# Altium schematic sheet MainDesign_small.SchDoc
size A2
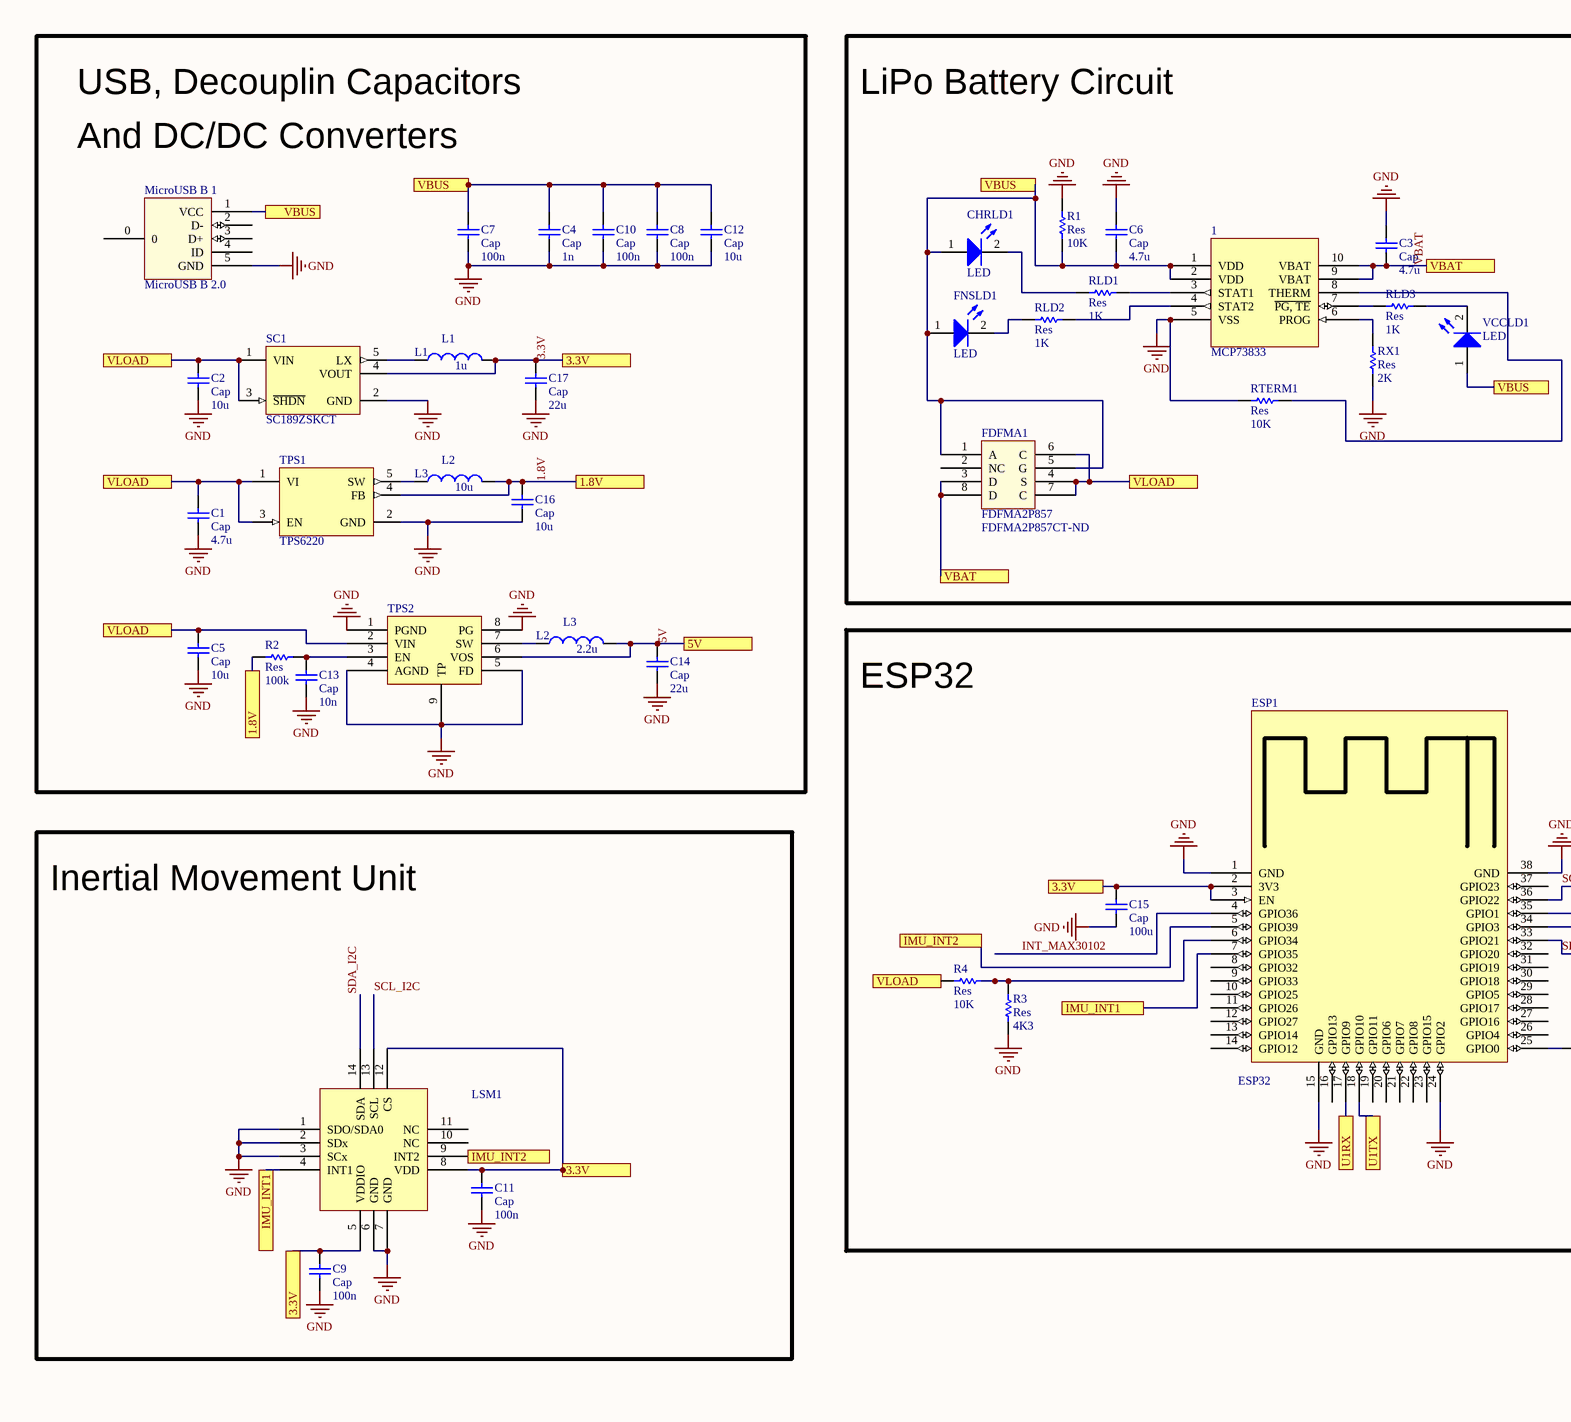
[diagram p0: MainDesign_small.SchDoc, left]
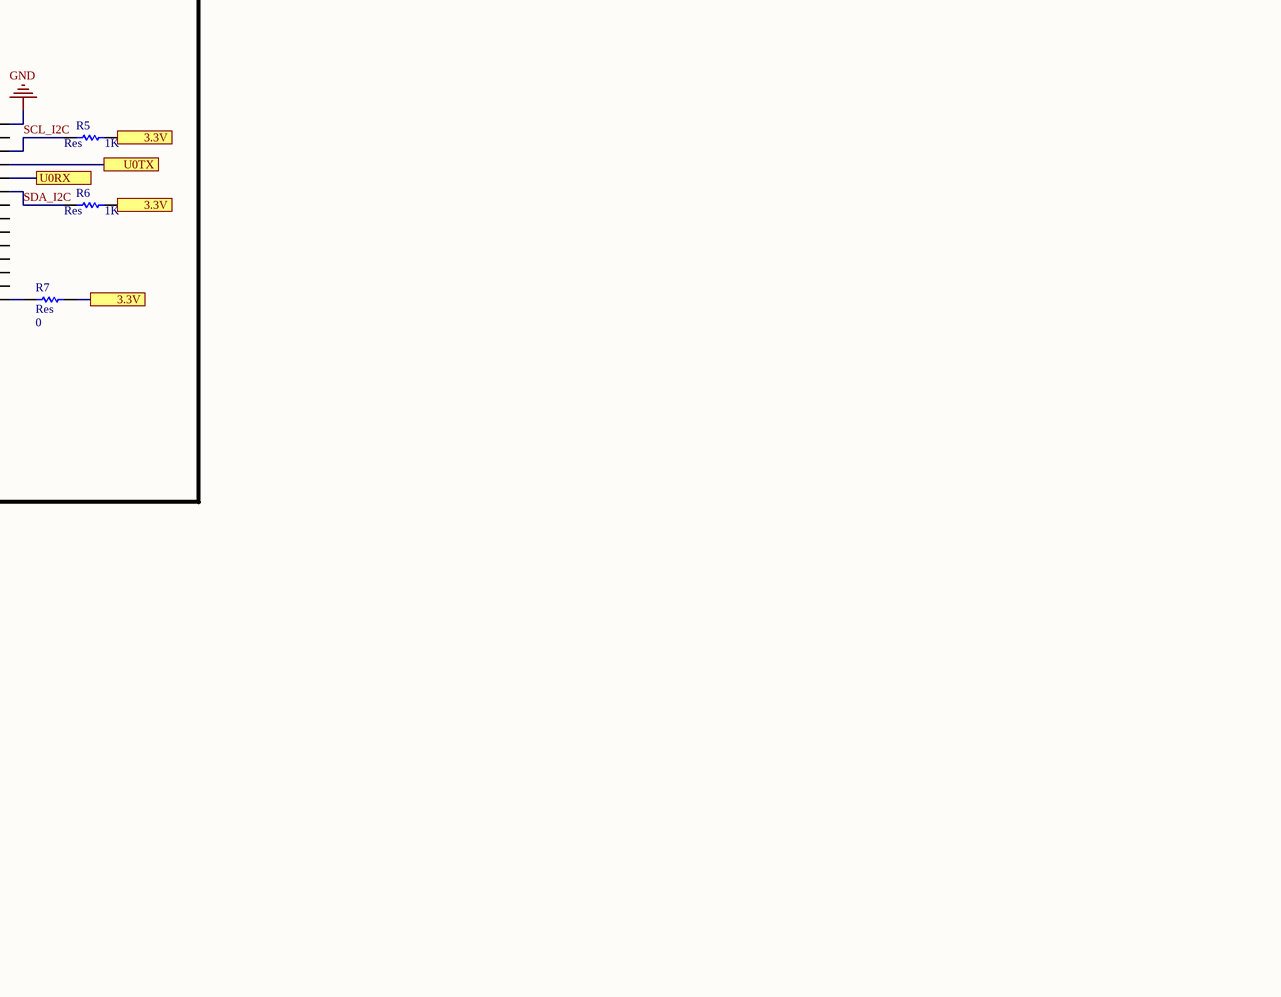
[diagram p1: MainDesign_small.SchDoc, right]

## Parts
1  MCP73833  [MCP73833/4]
C1  Cap  value 4.7u  [0603 Cap]
C2  Cap  value 10u  [0603 Cap]
C3  Cap  value 4.7u  [0603 Cap]
C4  Cap  value 1n  [0603 Cap]
C5  Cap  value 10u  [0603 Cap]
C6  Cap  value 4.7u  [0603 Cap]
C7  Cap  value 100n  [0603 Cap]
C8  Cap  value 100n  [0603 Cap]
C9  Cap  value 100n  [0603 Cap]
C10  Cap  value 100n  [0603 Cap]
C11  Cap  value 100n  [0603 Cap]
C12  Cap  value 10u  [0603 Cap]
C13  Cap  value 10n  [0603 Cap]
C14  Cap  value 22u  [0603 Cap]
C15  Cap  value 100u  [0603 Cap]
C16  Cap  value 10u  [0603 Cap]
C17  Cap  value 22u  [0603 Cap]
CHRLD1  LED  [0603 LED-BLUE]
ESP1  ESP32  [ESP32]
FDFMA1  FDFMA2P857  Supplier Part Number 1: FDFMA2P857CT-ND  [FDFMA2P857]
FNSLD1  LED  [0603 LED-BLUE]
L1  L1  value 1u  [0603 IND]
L2  L3  value 2.2u  [0603 IND]
L3  L2  value 10u  [0603 IND]
LSM1  LSM6DS3  [LSM6DS3]  (value not drawn)
MicroUSB_B_1  MicroUSB B 2.0  [MicroUSB B 2.0]
R1  Res  value 10K  [0603 Res]
R2  Res  value 100k  [0603 Res]
R3  Res  value 4K3  [0603 Res]
R4  Res  value 10K  [0603 Res]
R5  Res  value 1K  [0603 Res]
R6  Res  value 1K  [0603 Res]
R7  Res  value 0  [0603 Res]
RLD1  Res  value 1K  [0603 Res]
RLD2  Res  value 1K  [0603 Res]
RLD3  Res  value 1K  [0603 Res]
RTERM1  Res  value 10K  [0603 Res]
RX1  Res  value 2K  [0603 Res]
SC1  SC189ZSKCT  [SOT23-5]
TPS1  TPS6220  [SOT23-5]
TPS2  TPS62173DSGT  [TPS62173DSGT]  (value not drawn)
VCCLD1  LED  [0603 LED-BLUE]

## Blocks framed on the sheet
LiPo Battery Circuit: 1 C3 C6 CHRLD1 FDFMA1 FNSLD1 R1 RLD1-RLD3 RTERM1 RX1 VCCLD1
ESP32: C15 ESP1 R3-R7
Inertial Movement Unit: C9 C11 LSM1

## Ports
1.8V, 3.3V, 5V, IMU_INT1, IMU_INT2, U0RX, U0TX, U1RX, U1TX, VBAT, VBUS, VLOAD

## Nets
GND: 1.5(VSS) C1.1 C2.1 C3.2 C4.2 C5.2 C6.2 C7.2 C8.1 C9.2 C10.2 C11.1 C12.2 C13.1 C14.1 C15.1 C16.1 C17.1 ESP1.1(GND) ESP1.15(GND) ESP1.24(GPIO2) ESP1.38(GND) LSM1.1(SDO/SDA0) LSM1.2(SDx) LSM1.3(SCx) LSM1.6(GND) LSM1.7(GND) MicroUSB_B_1.5(GND) R1.2 R3.2 RTERM1.1 RX1.2 SC1.2(GND) TPS1.2(GND) TPS2.1(PGND) TPS2.4(AGND) TPS2.5(FD) TPS2.8(PG) TPS2.9(TP)
1.8V: C16.2 L3.2 R2.2 TPS1.4(FB) ; port 1.8V
3.3V: C9.1 C11.2 C15.2 C17.2 ESP1.2(3V3) ESP1.3(EN) L1.2 LSM1.5(VDDIO) LSM1.8(VDD) LSM1.12(CS) R5.2 R6.2 R7.1 SC1.4(VOUT) ; port 3.3V
5V: C14.2 L2.2 TPS2.6(VOS) ; port 5V
IMU_INT1: ESP1.7(GPIO35) LSM1.4(INT1) ; port IMU_INT1
IMU_INT2: ESP1.5(GPIO39) LSM1.9(INT2) ; port IMU_INT2
INT_MAX30102: ESP1.4(GPIO36)
SCL_I2C: ESP1.36(GPIO22) LSM1.13(SCL) R5.1
SDA_I2C: ESP1.33(GPIO21) LSM1.14(SDA) R6.1
U0RX: ESP1.34(GPIO3) ; port U0RX
U0TX: ESP1.35(GPIO1) ; port U0TX
U1RX: ESP1.17(GPIO9) ; port U1RX
U1TX: ESP1.18(GPIO10) ; port U1TX
VBAT: 1.9(VBAT) 1.10(VBAT) C3.1 FDFMA1.3(D) FDFMA1.8(D) ; port VBAT
VBUS: 1.1(VDD) 1.2(VDD) C4.1 C6.1 C7.1 C8.2 C10.1 C12.1 CHRLD1.1(A) FDFMA1.1(A) FDFMA1.5(G) FNSLD1.1(A) MicroUSB_B_1.1(VCC) R1.1 VCCLD1.1(A) ; port VBUS
VLOAD: C1.2 C2.2 C5.1 FDFMA1.4(S) FDFMA1.6(C) FDFMA1.7(C) R4.1 SC1.1(VIN) SC1.3(~{SHDN}) TPS1.1(VI) TPS1.3(EN) TPS2.2(VIN) ; port VLOAD
Net1_3: 1.3(STAT1) RLD1.1
Net1_4: 1.4(STAT2) RLD2.1
Net1_6: 1.6(PROG) RX1.1
Net1_7: 1.7(~{PG,_TE}) RLD3.2
Net1_8: 1.8(THERM) RTERM1.2
NetC13_2: C13.2 R2.1 TPS2.3(EN)
NetCHRLD1_2: CHRLD1.2(C) RLD1.2
NetESP1_6: ESP1.6(GPIO34) R3.1 R4.2
NetESP1_25: ESP1.25(GPIO0) R7.2
NetFNSLD1_2: FNSLD1.2(C) RLD2.2
NetL1_1: L1.1 SC1.5(LX)
NetL2_1: L2.1 TPS2.7(SW)
NetL3_1: L3.1 TPS1.5(SW)
NetRLD3_1: RLD3.1 VCCLD1.2(C)

Not connected (* = marked no-connect by the designer): ESP1 8(GPIO32) 9(GPIO33) 10(GPIO25) 11(GPIO26) 12(GPIO27) 13(GPIO14) 14(GPIO12) 16(GPIO13) 19(GPIO11) 20(GPIO6) 21(GPIO7) 22(GPIO8) 23(GPIO15) 26(GPIO4) 27(GPIO16) 28(GPIO17) 29(GPIO5) 30(GPIO18) 31(GPIO19) 32(GPIO20) 37(GPIO23); FDFMA1 2(NC); LSM1 10(NC) 11(NC); MicroUSB_B_1 0 2(D-) 3(D+) 4(ID)

## Notes on the sheet
- USB, Decouplin Capacitors
- And DC/DC Converters
- HELLO WORLD

## Library data of the parts
L1-L3 = Ind
SC1 = MCP1603T-330I/OS: 500mA Synchronous Buck Regulator, 3.3V, 2.0 MHz, 5-Pin TSOT, Industrial Temperature, Tape and Reel; Published: 29-Jan-2009; DatasheetVersion: revA, May-2007; PackageVersion: revAW, Oct-2008; PackageReference: TSOT-OS5; Publisher: Altium Limited; PackageDescription: 5-Lead Plastic Small Outline Transistor (OS) [TSOT]; ComponentLink1Description: Manufacturer Link; ComponentLink1URL: http://www.microchip.com; ComponentLink2Description: Datasheet; ComponentLink2URL: http://ww1.microchip.com/downloads/en/DeviceDoc/22042a.pdf; ComponentLink3Description: Packaging Specification; ComponentLink3URL: http://ww1.microchip.com/downloads/en/PackagingSpec/00049AW.pdf
1 = MCP73833: Supplier 1: Digi-Key; Supplier Part Number 1: MCP73833T-AMI/UNCT-ND
FDFMA1 = FDFMA2P857: Supplier 1: Digi-Key
LSM1 = LSM6DS3: Supplier 1: Digi-Key; Supplier Part Number 1: 497-15383-1-ND
TPS1 = TPS6220: Published: 29-Jan-2009; DatasheetVersion: revA, May-2007; PackageVersion: revAW, Oct-2008; PackageReference: TSOT-OS5; Publisher: Altium Limited; PackageDescription: 5-Lead Plastic Small Outline Transistor (OS) [TSOT]; ComponentLink1Description: Manufacturer Link; ComponentLink1URL: http://www.microchip.com; ComponentLink2Description: Datasheet; ComponentLink2URL: http://ww1.microchip.com/downloads/en/DeviceDoc/22042a.pdf; ComponentLink3Description: Packaging Specification; ComponentLink3URL: http://ww1.microchip.com/downloads/en/PackagingSpec/00049AW.pdf
TPS2 = TPS62173DSGT: Published: 29-Jan-2009; DatasheetVersion: revA, May-2007; PackageVersion: revAW, Oct-2008; PackageReference: TSOT-OS5; Publisher: Altium Limited; PackageDescription: 5-Lead Plastic Small Outline Transistor (OS) [TSOT]; ComponentLink1Description: Manufacturer Link; ComponentLink1URL: http://www.microchip.com; ComponentLink2Description: Datasheet; ComponentLink2URL: http://ww1.microchip.com/downloads/en/DeviceDoc/22042a.pdf; ComponentLink3Description: Packaging Specification; ComponentLink3URL: http://ww1.microchip.com/downloads/en/PackagingSpec/00049AW.pdf